# EAGLE board board (EAGLE 9.5.2)
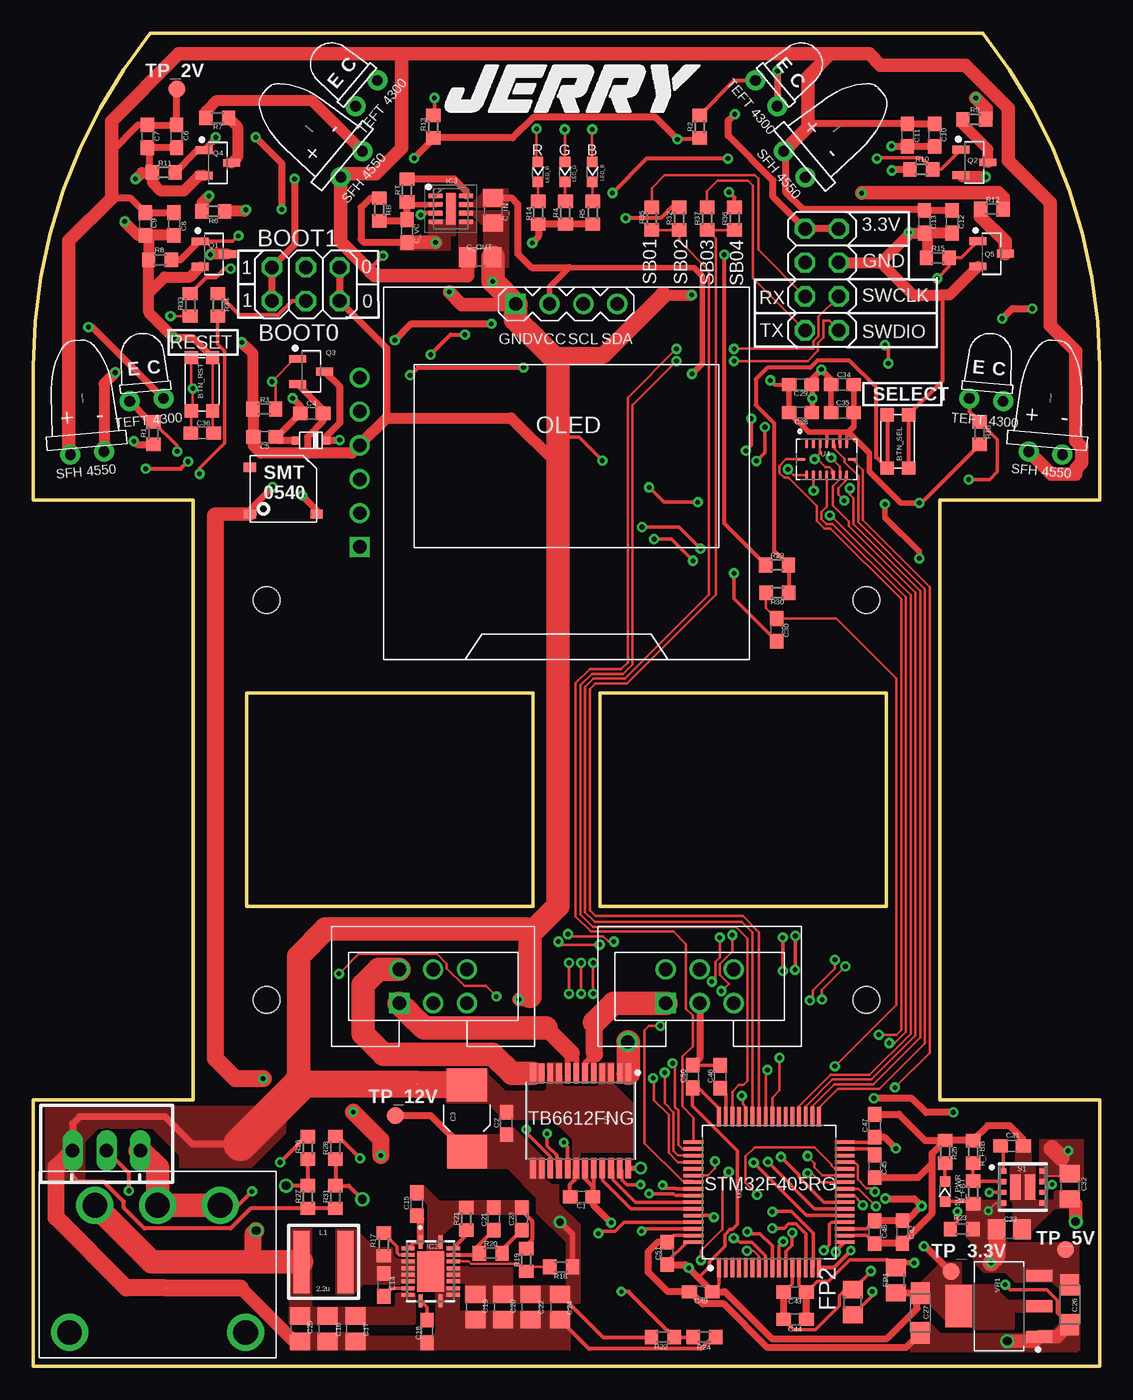
[diagram p3: board, top side]
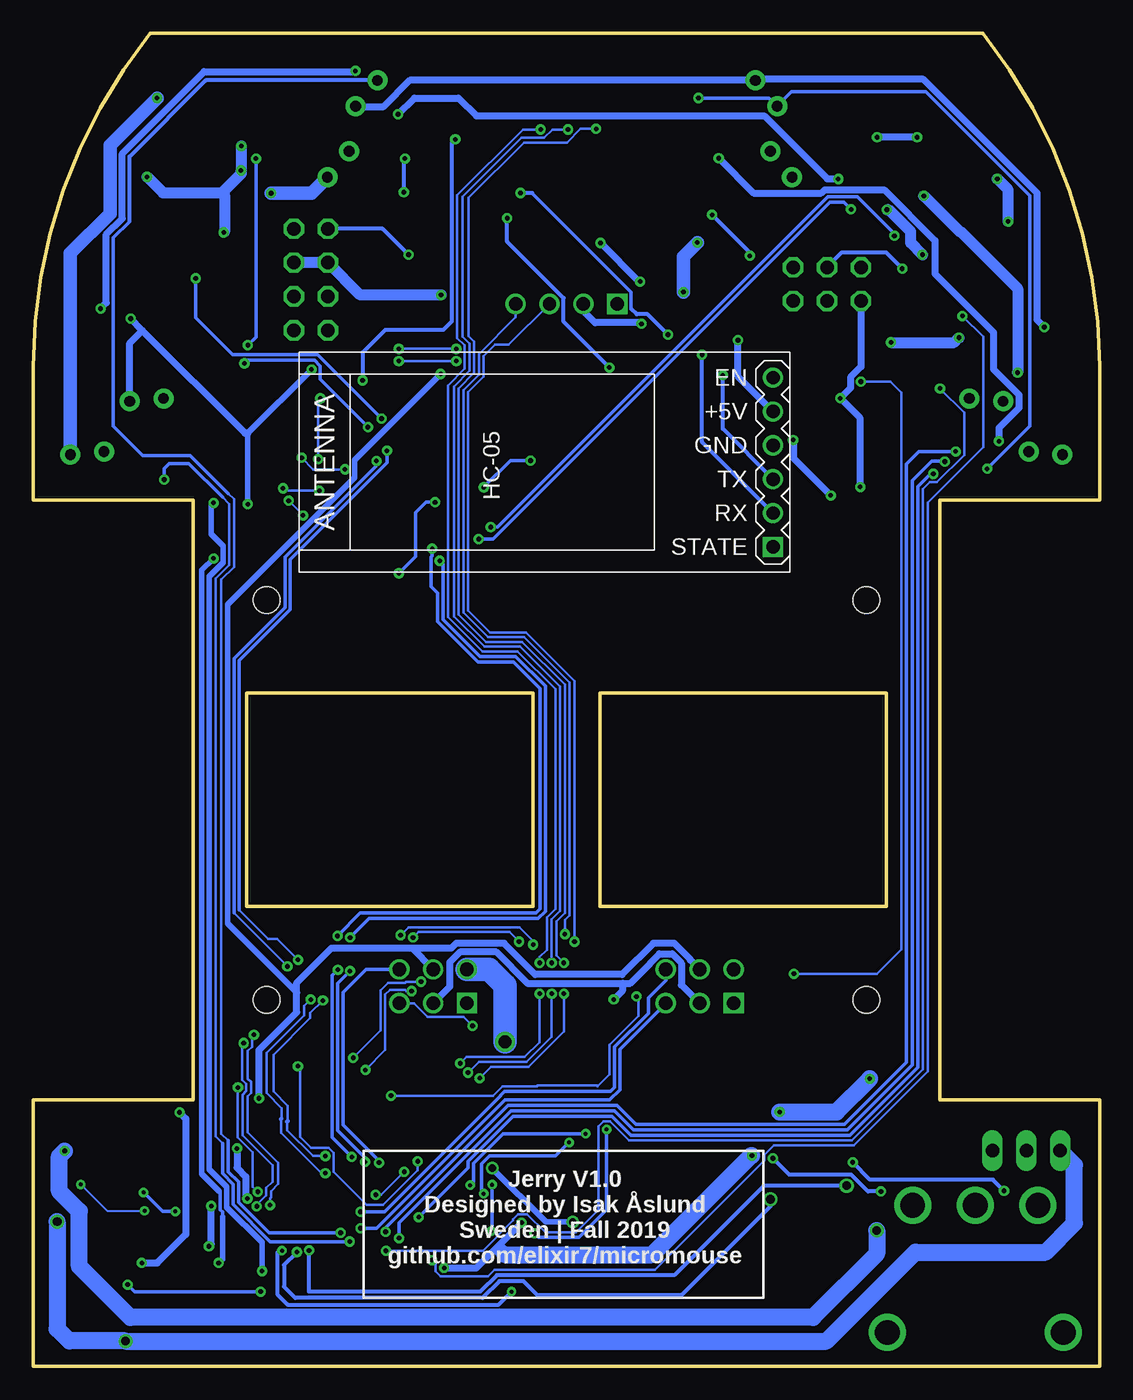
[diagram p4: board, bottom side, seen from below]

Size 80 x 100 mm. Coordinates in mm from the lower left corner, seen from the top.
Outline: 0,0 80,0 80,20 68,20 68,65 80,65 80,75 arc39 71.22,100 8.78,100 arc39 0,75 0,65 12,65 12,20 0,20 0,0
Outline: 42.5,34.5 42.5,50.5 64,50.5 64,34.5 42.5,34.5
Outline: 16,50.5 37.5,50.5 37.5,34.5 16,34.5 16,50.5
Copper layers (1*16): Top 0.035mm / dielectric 1.5mm / Bottom 0.035mm
Design rules "default *": minimum track width 6mil, minimum drill 0.3mm, track to track 6mil, track to pad 6mil, pad to pad 6mil, via to via 6mil, smd to smd 6mil, copper to edge 10mil, drill to drill 6mil, minimum pad ring 10mil, minimum via ring 8mil, stop-mask expansion 0mil, vias tented up to drill 12mil, thermal gap 10mil
Holes 2 mm at 17.5,57.5 17.5,27.5 62.5,57.5 62.5,27.5

## Footprints (pad centres in the part's own frame; a part is rotated, then mirrored left to right if it is on the bottom)
CHIP-LED0603 = smd 0.8 x 0.8: A 0,-0.75; C 0,0.75
2X03 = drill 1.016 octagon: 1 -2.54,-1.27; 2 -2.54,1.27; 3 0,-1.27; 4 0,1.27; 5 2.54,-1.27; 6 2.54,1.27
KMR621NGLFS = smd 1 x 1: 1 -2,-0.8; 2 2,-0.8; 3 -2,0.8; 4 2,0.8
C0603 = smd 1.1 x 1: 1 -0.85,0; 2 0.85,0
EIA_6032-28 = smd 2.5 x 3: 1 -2.5,0; 2 2.5,0
C0805 = smd 1.3 x 1.5: 1 -0.95,0; 2 0.95,0
SMC_A = smd 1.6 x 1.4: + -1.5,0; - 1.5,0
3MM_PHOTOTRANSISTOR = drill 0.8 pad 1.5: C 1.27,0; E -1.27,0
2X04 = drill 1.016 octagon: 1 -3.81,-1.27; 2 -3.81,1.27; 3 -1.27,-1.27; 4 -1.27,1.27; 5 1.27,-1.27; 6 1.27,1.27; 7 3.81,-1.27; 8 3.81,1.27
SFH_4545 = drill 0.8 pad 1.5: + -1.27,-0.5; - 1.27,-0.5
R0805 = smd 1.3 x 1.5: 1 -0.95,0; 2 0.95,0
WIRELESS-BLUETOOTH-HC-05 = drill 1 square: 1 -6.35,-17.145 | drill 1: 2 -3.81,-17.145; 3 -1.27,-17.145; 4 1.27,-17.145; 5 3.81,-17.145; 6 6.35,-17.145
RHL(R-PVQFN-N20)_1 = smd 0.99 x 0.3: 1 -2.2,-0.75; 10 2.2,-0.75; 11 2.2,0.75; 20 -2.2,0.75 | smd 0.3 x 0.99: 2 -1.75,-1.7; 3 -1.25,-1.7; 4 -0.75,-1.7; 5 -0.25,-1.7; 6 0.25,-1.7; 7 0.75,-1.7; 8 1.25,-1.7; 9 1.75,-1.7; 12 1.75,1.7; 13 1.25,1.7; 14 0.75,1.7; 15 0.25,1.7; 16 -0.25,1.7; 17 -0.75,1.7; 18 -1.25,1.7; 19 -1.75,1.7 | smd 3.05 x 2.05: 21 0,0
SON65P260X300X150-9N = smd 1.05 x 0.35: 1 -1.15,0.975; 2 -1.15,0.325; 3 -1.15,-0.325; 4 -1.15,-0.975; 5 1.15,-0.975; 6 1.15,-0.325; 7 1.15,0.325; 8 1.15,0.975 | smd 0.7 x 2.35: 9 0,0
XAL5030 = smd 1.18 x 4.7: 1 -1.655,0; 2 1.655,0
IE2-1024-ENCODER = drill 1.016 square: 1 -2.54,-1.27 | drill 1.016: 2 -2.54,1.27; 3 0,-1.27; 4 0,1.27; 5 2.54,-1.27; 6 2.54,1.27
DISPLAY-OLED-128X64-I2C = drill 1 square: 1 -3.81,12.7 | drill 1: 2 -1.27,12.7; 3 1.27,12.7; 4 3.81,12.7
SOT95P235X110-3 = smd 1.28 x 0.589: 1 -1.016,0.95; 2 -1.016,-0.95; 3 1.016,0
R0603 = smd 1 x 1.1: 1 -0.85,0; 2 0.85,0
LMZ21701 = smd 0.45 x 0.4: 1 -1.475,1.2; 2 -1.475,0.4; 3 -1.475,-0.4; 4 -1.475,-1.2; 5 1.475,-1.2; 6 1.475,-0.4; 7 1.475,0.4; 8 1.475,1.2 | smd 0.8 x 1.9: 9 -0.55,0; 10 0.55,0
500SSP1S1M6QEA = drill 1.85: 1 -4.7,0; 2_COM 0,0; 3 4.7,0; MOUNT@1 -6.605,9.53; MOUNT@2 6.605,9.53
PAD.03X.05 = smd 1.27 x 1.27: P$1 0,0
SOP65P760X160-24 = smd 1.515 x 0.417: 1 -3.548,3.575; 2 -3.548,2.925; 3 -3.548,2.275; 4 -3.548,1.625; 5 -3.548,0.975; 6 -3.548,0.325; 7 -3.548,-0.325; 8 -3.548,-0.975; 9 -3.548,-1.625; 10 -3.548,-2.275; 11 -3.548,-2.925; 12 -3.548,-3.575; 13 3.548,-3.575; 14 3.548,-2.925; 15 3.548,-2.275; 16 3.548,-1.625; 17 3.548,-0.975; 18 3.548,-0.325; 19 3.548,0.325; 20 3.548,0.975; 21 3.548,1.625; 22 3.548,2.275; 23 3.548,2.925; 24 3.548,3.575
LQFP-64 = smd 1.469 x 0.28: 1 -5.671,3.75; 2 -5.671,3.25; 3 -5.671,2.75; 4 -5.671,2.25; 5 -5.671,1.75; 6 -5.671,1.25; 7 -5.671,0.75; 8 -5.671,0.25; 9 -5.671,-0.25; 10 -5.671,-0.75; 11 -5.671,-1.25; 12 -5.671,-1.75; 13 -5.671,-2.25; 14 -5.671,-2.75; 15 -5.671,-3.25; 16 -5.671,-3.75; 33 5.671,-3.75; 34 5.671,-3.25; 35 5.671,-2.75; 36 5.671,-2.25; 37 5.671,-1.75; 38 5.671,-1.25; 39 5.671,-0.75; 40 5.671,-0.25; 41 5.671,0.25; 42 5.671,0.75; 43 5.671,1.25; 44 5.671,1.75; 45 5.671,2.25; 46 5.671,2.75; 47 5.671,3.25; 48 5.671,3.75 | smd 0.28 x 1.469: 17 -3.75,-5.671; 18 -3.25,-5.671; 19 -2.75,-5.671; 20 -2.25,-5.671; 21 -1.75,-5.671; 22 -1.25,-5.671; 23 -0.75,-5.671; 24 -0.25,-5.671; 25 0.25,-5.671; 26 0.75,-5.671; 27 1.25,-5.671; 28 1.75,-5.671; 29 2.25,-5.671; 30 2.75,-5.671; 31 3.25,-5.671; 32 3.75,-5.671; 49 3.75,5.671; 50 3.25,5.671; 51 2.75,5.671; 52 2.25,5.671; 53 1.75,5.671; 54 1.25,5.671; 55 0.75,5.671; 56 0.25,5.671; 57 -0.25,5.671; 58 -0.75,5.671; 59 -1.25,5.671; 60 -1.75,5.671; 61 -2.25,5.671; 62 -2.75,5.671; 63 -3.25,5.671; 64 -3.75,5.671
PQFN50P450X300X100-16N = smd 0.25 x 0.675: 1 -1.5,1.165; 2 -1,1.165; 3 -0.5,1.165; 4 0,1.165; 5 0.5,1.165; 6 1,1.165; 7 1.5,1.165; 9 1.5,-1.165; 10 1,-1.165; 11 0.5,-1.165; 12 0,-1.165; 13 -0.5,-1.165; 14 -1,-1.165; 15 -1.5,-1.165 | smd 0.675 x 0.25: 8 1.915,0; 16 -1.915,0
1N4148WX_SOD-323-2 = smd 0.6 x 0.6: + -0.935,-0.035; - 1.365,-0.035
SMT-0540-S-R = smd 0.7 x 0.9: + 1.9,-2.4; - 1.9,2.6; DUMMY_LEAD -1.6,-2.4
SPLITTER = smd 0.102 x 0.102: 1 0,0; 2 0,0
JST-XH-03 = drill 1.016 long: 1 -2.54,0; 2 0,0; 3 2.54,0
SOT230P700X180-4 = smd 1.965 x 0.889: 1 -3.023,2.3; 2 -3.023,0; 3 -3.023,-2.3 | smd 1.965 x 3.189: 4 3.023,0

## Placement (x,y rotation side)
5V_PWR  CHIP-LED0603  [CHIP-LED0603]  68.41,13.1 0 top
BOOT  [2X03]  20.44,81.18 0 top
BTN_RST  KMR621NGLFS  [KMR621NGLFS]  12.66,73.67 90 top
BTN_SEL  KMR621NGLFS  [KMR621NGLFS]  64.87,69.38 270 top
C1  0.1u  [C0603]  41.13,12.71 180 top
C2  0.1u  [C0603]  35.5,18.22 90 top
C3  10u  [EIA_6032-28]  32.53,18.61 90 top
C4  0.1u  [C0603]  20.89,71.49 0 top
C5  10u  [C0603]  17.36,69.72 180 top
C6  0.1u  [C0603]  10.75,92.27 270 top
C7  10u  [C0603]  8.57,92.27 270 top
C8  0.1u  [C0603]  10.56,85.69 270 top
C9  10u  [C0603]  8.4,85.69 270 top
C10  0.1u  [C0603]  67.62,92.36 270 top
C11  10u  [C0603]  65.58,92.36 270 top
C12  0.1u  [C0603]  68.94,85.86 270 top
C13  10u  [C0603]  66.85,85.86 270 top
C14  0.1u  [C0603]  26.3,6.09 270 top
C15  2.2u  [C0603]  28.78,12.15 90 top
C16  0.1u  [C0805]  22.09,2.81 270 top
C17  22u  [C0805]  24.18,2.81 270 top
C18  0.1u  [C0603]  29.54,2.6 270 top
C19  22u  [C0805]  33.18,4.45 270 top
C20  22u  [C0805]  35.26,4.45 270 top
C21  15p  [C0603]  34.55,11.06 90 top
C22  22u  [C0805]  37.31,4.45 270 top
C23  330p  [C0603]  36.65,11.06 90 top
C24  1u  [C0805]  39.51,4.45 270 top
C25  22u  [C0805]  20.01,2.81 270 top
C26  10u  [SMC_A]  77.75,4.61 270 top
C27  10u  [SMC_A]  66.56,4 270 top
C28  0.1u  [C0603]  57.56,71.55 180 top
C29  2.2u  [C0603]  57.56,73.64 180 top
C30  0.1u  [C0603]  55.77,55.24 270 top
C31  3300p  [C0603]  73.43,16.53 0 top
C32  22u  [C0805]  77.78,13.51 270 top
C33  22u  [C0805]  73.23,10.26 0 top
C34  0.1u  [C0603]  60.71,73.64 0 top
C35  0.1u  [C0603]  60.71,71.55 0 top
C36  0.1u  [C0603]  12.68,70.01 0 top
C42  10u  [C0603]  65.2,10.07 270 top
C43  0.1u  [C0603]  57.16,5.55 180 top
C44  1u  [C0603]  57.16,3.52 180 top
C45  2.2u  [C0603]  63.12,15.01 270 top
C46  2.2u  [C0603]  51.53,21.72 90 top
C47  0.1u  [C0603]  63.13,18.05 90 top
C48  0.1u  [C0603]  63.12,10.06 270 top
C49  0.1u  [C0603]  50.08,5.58 180 top
C50  0.1u  [C0603]  49.47,21.73 90 top
C51  0.1u  [C0603]  47.57,8.47 90 top
C_IN  10u  [C0805]  34.51,86.7 270 top
C_OUT  10u  [C0805]  33.53,83.2 0 top
C_VC  470pF  [C0603]  28.04,85.17 270 top
D4  TEFT4300  [3MM_PHOTOTRANSISTOR]  25,95.5 50 top
D5  TEFT4300  [3MM_PHOTOTRANSISTOR]  8.5,72.5 5 top
D6  TEFT4300  [3MM_PHOTOTRANSISTOR]  55,95.5 310 top
D8  TEFT4300  [3MM_PHOTOTRANSISTOR]  71.5,72.5 355 top
DEBUG  [2X04]  59.17,81.53 270 top
FL_EMITTER  SFH_4545  [SFH_4545]  4,69 5 top
FP1  10u  [R0805]  64.71,6.46 90 top
FP2  10u  [R0805]  61.49,4.8 90 top
FR_EMITTER  SFH_4545  [SFH_4545]  76,69 355 top
HC-05  WIRELESS-BLUETOOTH-HC-05  [WIRELESS-BLUETOOTH-HC-05]  41.64,67.82 90 bottom
IC2  TPS61088RHLR  [RHL(R-PVQFN-N20)_1]  29.81,7.11 270 top
IC3  LMZ10501  [SON65P260X300X150-9N]  31.33,86.83 0 top
L1  2.2u  [XAL5030]  21.78,7.82 0 top
L_EMITTER  SFH_4545  [SFH_4545]  23.5,90.5 50 top
LED_B  CHIP-LED0603  [CHIP-LED0603]  41.95,89.6 180 top
LED_G  CHIP-LED0603  [CHIP-LED0603]  39.9,89.6 180 top
LED_R  CHIP-LED0603  [CHIP-LED0603]  37.86,89.6 180 top
MOTOR_LEFT  IE2-1024-ENCODER  [IE2-1024-ENCODER]  50,28.5 0 top
MOTOR_RIGHT  IE2-1024-ENCODER  [IE2-1024-ENCODER]  30,28.5 0 top
OLED  DISPLAY-OLED-128X64-I2C  [DISPLAY-OLED-128X64-I2C]  40,67 0 top
Q1  IRFML8244TRPBF  [SOT95P235X110-3]  13.55,83.44 0 top
Q2  IRFML8244TRPBF  [SOT95P235X110-3]  70.6,90.31 0 top
Q3  IRFML8244TRPBF  [SOT95P235X110-3]  20.85,74.63 0 top
Q4  IRFML8244TRPBF  [SOT95P235X110-3]  13.85,90.27 0 top
Q5  IRFML8244TRPBF  [SOT95P235X110-3]  71.9,83.46 0 top
R1  1.8k  [R0603]  9,70 90 top
R2  1.8k  [R0603]  50,93 90 top
R3  10k  [R0603]  17.34,71.81 0 top
R4  1k  [R0603]  39.93,86.53 90 top
R5  1k  [R0603]  41.98,86.53 90 top
R6  0.75  [R0603]  13.5,86.64 180 top
R7  0.75  [R0603]  13.81,93.66 180 top
R8  10k  [R0603]  9.51,83.01 0 top
R9  0.75  [R0603]  70.59,93.55 0 top
R10  10k  [R0603]  66.61,89.8 0 top
R11  10k  [R0603]  9.79,89.56 0 top
R12  0.75  [R0603]  71.92,86.81 0 top
R13  1.8k  [R0603]  30,93 90 top
R14  1k  [R0603]  37.89,86.53 90 top
R15  10k  [R0603]  67.86,83.15 0 top
R16  1.8k  [R0603]  71,70 90 top
R17  150k  [R0603]  26.29,9.13 90 top
R18  180k  [R0603]  39.61,7.45 180 top
R19  20k  [R0603]  37,7.97 90 top
R20  56k  [R0603]  34.32,8.47 0 top
R21  112k  [R0603]  32.48,11.06 90 top
R22  47k  [R0603]  47.23,2.18 180 top
R23  10k  [R0603]  69.66,10.29 0 top
R24  10k  [R0603]  50.36,2.2 180 top
R25  1k  [R0603]  68.41,16.09 270 top
R26  20k  [R0603]  20.59,16.38 90 top
R27  10k  [R0603]  20.59,12.69 90 top
R28  20k  [R0603]  22.67,16.39 90 top
R29  100k  [R0603]  55.8,60.11 0 top
R30  10k  [R0603]  55.83,58.03 180 top
R31  10k  [R0603]  22.67,12.7 90 top
R32  0  [R0603]  48.47,86.09 90 top
R33  10k  [R0603]  11.77,79.62 90 top
R34  10k  [R0603]  13.84,79.62 270 top
R35  0  [R0603]  46.4,86.09 90 top
R36  0  [R0603]  52.61,86.09 90 top
R37  0  [R0603]  50.55,86.09 90 top
R_EMITTER  SFH_4545  [SFH_4545]  57.5,90.5 310 top
R_FBB  20k  [R0603]  70.51,16.08 270 top
R_FBT  105k  [R0603]  70.51,13.03 90 top
RB  150k  [R0603]  25.97,86.78 270 top
RT  290k  [R0603]  28.04,88.21 90 top
S1  LMZ21701  [LMZ21701]  74.24,13.44 0 top
SW  SPDT-500SSP1S1M6QEA  [500SSP1S1M6QEA]  9.32,12.06 180 top
TP_2V  TEST-POINT3X5  [PAD.03X.05]  10.79,95.82 0 top
TP_3.3V  TEST-POINT3X5  [PAD.03X.05]  68.85,7.09 0 top
TP_5V  TEST-POINT3X5  [PAD.03X.05]  77.46,8.76 0 top
TP_12V  TEST-POINT3X5  [PAD.03X.05]  27.15,18.8 0 top
U1  TB6612FNG  [SOP65P760X160-24]  41.07,18.41 270 top
U3  STM32F405RG  [LQFP-64]  55.2,13.06 90 top
U4  BMI088  [PQFN50P450X300X100-16N]  59.53,68.04 0 top
U$1  1N4148WX  [1N4148WX_SOD-323-2]  20.62,69.47 0 top
U$4  SMT-0540-S-R  [SMT-0540-S-R]  18.65,65.83 270 top
U$6  SPLITTER  [SPLITTER]  28.76,21.16 90 top
U$7  SPLITTER  [SPLITTER]  9.94,5.87 90 top
U$10  JST-XH-3  [JST-XH-03]  5.49,16.17 0 top
VR1  LM1117-3.3  [SOT230P700X180-4]  72.45,4.5 180 top

## Tracks (layer width: path | path; a pad name or v marks a point on that pad's centre or on a via)
2V  (via drill 0.35)
  Top 0.305: IC3.3 30.17,86.51 29.2,86.51 v29.07,86.39 | v26.24,83.31 25.29,82.36 25.29,82.16
  Top 0.508: TP_2V.P$1 10.75,95.78 C6.1 C7.1 7.85,93.11 5.87,91.14 | C8.1 C9.1 7.31,87.63 5.87,87.63 | C10.1 C11.1 58.36,93.21 58.12,92.97 | R_EMITTER.+ 56.44,91.01 56.44,88.09 57.73,86.79 66.77,86.79 C13.1 C12.1
  Top 1.016: C_OUT.1 32.58,81.81 25.63,81.81 25.29,82.16 23.07,84.38 L_EMITTER.+ 23.32,89.46 25.73,89.46 27.64,91.36 27.64,98.27 27.46,98.45 | FL_EMITTER.+ 2.67,68.5 2.67,84.43 5.87,87.63 5.87,91.14 5.87,93.4 10.92,98.45 27.46,98.45 | 27.46,98.45 59.82,98.45 | 59.82,98.45 62.71,98.45 63.55,97.61 69.93,97.61 73.15,94.39 73.15,90.45 76.3,87.3 76.3,78.05 78.21,76.15 78.21,69.41 78.68,68.94 78.68,67.79 78.21,67.32 78.21,66.93 76.38,66.93 FR_EMITTER.+ | R_EMITTER.+ 58.12,92.97 58.12,96.75 59.82,98.45
  Bottom 0.305: v29.07,86.39 26.24,83.55 v26.24,83.31
  pour Top (no thermals): 31.95,85.98 32.97,85.98 33.25,85.7 33.25,82.42 31.95,82.42
3.3V  (via drill 0.35)
  Top 0.254: C51.1 47.57,7.85 49.02,9.31 U3.64 | C49.1 51.45,6.11 U3.1 | C47.1 62.74,16.81 U3.32 | U3.19 62.52,10.31 C48.1 | U3.48 51.45,19.33 49.9,20.88 C50.1 49.47,19.52 52.83,16.15 52.83,10.64 52.45,10.26 52.28,10.26 51.9,9.87 51.9,8.99 50.75,7.85 50.75,7.47 49.91,6.63
  Top 0.305: U1.19 41.35,14.82 41.35,14.1 41.98,13.47 C1.1 42.04,12.77 42.05,12.78 U1.20 | R29.1 51.84,63.22 v51.84,83.39
  Top 0.508: 66.31,5.5 C27.+ | C48.1 C42.1 65.56,10.92 v66.65,12.01 66.09,12.57 v63.94,12.57 | C51.1 48.92,7.62 v49.17,7.37 49.91,6.63 50.93,5.61 C49.1 51.89,5.58 55.42,2.06 64.04,2.06 66.31,4.32 66.31,5.5 | v43.36,10.77 42.04,12.09 42.04,12.77 | TP_3.3V.P$1 66.95,8.99 v66.83,8.99 | C47.1 63.85,17.2 v64.72,16.33 | FP1.1 66.3,5.51 66.31,5.5 | U$1.+ 18.49,69.44 C5.1 18.27,69.72 C4.1 20.04,72.03 v19.46,72.62 | U$4.+ 16.25,64.26 v17.96,65.96 | DEBUG.2 DEBUG.1 55.5,87.74 55.5,88.95 52.15,92.3 52.15,93.45 v52.63,93.93 | v19.61,89.08 19.61,84.16 BOOT.2 BOOT.1
  Top 1.016: 13.68,63.8 13.8,63.93 U$4.+
  Top 1.27: v26.09,15.8 26.09,16.99 v24,19.07 | v17.25,21.57 15.18,21.57 13.68,23.06 13.68,63.8
  Bottom 0.305: v51.84,83.39 53.79,85.34 DEBUG.1
  Bottom 0.508: v49.17,7.37 46.76,7.37 45.36,8.76 | 45.36,8.76 v43.36,10.77 | v66.83,8.99 66.65,9.17 v66.65,12.01 | v64.72,16.33 64.72,14.88 64.06,14.22 64.06,12.7 v63.94,12.57 | v17.96,65.96 17.96,71.12 v19.46,72.62 18.69,73.38 18.69,74.19 17.9,74.98 BOOT.1 | 45.36,8.76 45.03,8.76 | v52.63,93.93 51.41,95.15 48.11,95.15 46.76,93.8 25.15,93.8 20.42,89.08 v19.61,89.08
  Bottom 1.016: 45.03,8.76 44.63,8.36
  Bottom 1.27: 44.63,8.36 33.59,8.36 26.14,15.8 v26.09,15.8 | v24,19.07 19.74,19.07 v17.25,21.57
  pour Top (no thermals): 65.89,6.27 65.89,4.67 67.16,4.67 67.21,4.72 68.48,3.45 68.48,2.95 70.41,2.95 70.59,2.77 73.56,2.77 73.56,4.06 76.4,4.06 76.45,4.11 76.45,4.9 76.43,4.93 73.08,4.93 71.91,6.1 69.62,6.1 69.62,7.8 68.12,7.8 66.6,6.27
3.3VA  (via drill 0.35)
  Top 0.203: U4.3 59.03,68.45 v58.62,68.05 58.86,68.05 59.44,67.47 59.72,67.47 59.91,67.28 59.91,67 U4.11
  Top 0.254: U3.13 57.45,6.11 C43.1 58.83,6.38 59.66,6.38 61.28,7.99 64.13,7.99 FP1.2
  Top 0.406: FP1.2 65.05,7.75 v66.09,7.75 | C35.1 C34.1 59.86,74.05 v59.13,74.78 58.41,74.06 C29.1 58.46,73.59 v58.46,72.61 58.46,71.6 C28.1 | v63.91,64.67 63.91,63.68 66.48,61.1 v66.48,60.6
  Top 0.508: C44.1 C43.1 | v72.69,78.59 73.46,79.35 v74.95,79.35 | v55.83,97.18 55.82,97.17 D6.C | v4.14,77.95 4.42,77.95 D5.C
  Bottom 0.203: v58.46,72.61 58.62,72.45 v58.62,68.05
  Bottom 0.254: 65.81,11.2 65.81,11.58 65.96,11.73 65.96,13.03 66.06,13.13
  Bottom 0.406: v66.09,7.75 65.81,8.03 65.81,11.2 | 66.06,13.13 67.36,14.43 67.36,59.72 v66.48,60.6 | v63.91,64.67 63.91,70 v59.13,74.78
  Bottom 0.508: 63.91,70 64.11,70 71.82,77.71 | 71.82,77.71 v72.69,78.59 | v74.95,79.35 74.52,79.78 74.52,84.91 73.33,86.11 73.33,90.98 67.18,97.13 55.88,97.13 v55.83,97.18 | D8.C 72.77,76.77 71.82,77.71 | D6.C 55.75,94.46 53.77,94.46 51.76,96.47 D4.C 25.74,96.55 13.22,96.55 4.7,88.03 4.7,78.51 v4.14,77.95
5V  (via drill 0.3, 0.35)
  Top 0.152: S1.6 75.85,13.04 v76.45,13.64 | v71.65,11.66 72.23,12.24 S1.4
  Top 0.254: 5V_PWR.A 70.34,12.35 R_FBT.1
  Top 0.406: v49.43,74.45 50.22,75.23 50.22,81.76 49.55,82.42 40.21,82.42 38.73,80.94 OLED.2
  Top 0.508: v69.03,19.04 v69.02,19.04 66.99,19.04 65.93,20.09 v63.07,20.09 | C_IN.1 35.9,87.65 36.35,87.2 36.35,83.46 37.39,82.42 40.21,82.42 | v27.13,76.99 28.35,78.21 v34.37,78.21
  Top 1.27: C33.1 72.28,8.17 v71.86,7.75
  Bottom 0.152: v76.45,13.64 74.46,11.66 v71.65,11.66
  Bottom 0.406: 60.23,28.04 65.43,33.23 65.43,57.13 55.88,66.68 55.88,67.99 v49.43,74.45
  Bottom 0.508: v71.86,7.75 70.69,7.75 68.55,9.88 68.55,18.56 v69.03,19.04 | v63.07,20.09 63.07,23.72 60.23,26.56 60.23,28.04 60.23,28.77 57.63,31.37 51.6,31.37 | MOTOR_LEFT.4 51.6,31.37 | 51.6,31.37 48.63,31.37 48.27,31.73 44.68,31.73 42.34,29.39 35.81,29.39 33.48,31.73 31.91,31.73 30.71,30.53 30.71,30.48 MOTOR_RIGHT.4 | HC-05.5 27.13,74.26 v27.13,76.99 | v34.37,78.21 34.44,78.28 37.85,78.28 38.38,78.82 38.73,79.17 OLED.2
  pour Top (no thermals): 69.98,12.67 71.07,12.67 71.09,12.65 71.09,12.45 72.85,12.45 72.85,9.55 73.13,9.27 78.46,9.27 78.46,5.36 78.49,5.33 77.11,5.33 77.09,5.31 77.09,5.71 76.45,6.35 73.69,6.35 72.97,7.06 71.35,7.06 70.59,7.82 70.59,9.14 70,9.73 70,12.65
  pour Top (no thermals): 31.98,87.3 31.98,86.94 35.61,86.94 35.61,88.29 33.73,88.29 33.73,88.04 32.99,87.3
12V  (via drill 0.55)
  Top 0.305: C24.1 42.73,2.18 R22.2
  Top 0.406: U1.24 v45.57,14.86 | v39.52,10.82 40.46,9.89 R18.1
  Top 0.508: C3.1 29.84,18.8 TP_12V.P$1
  Bottom 0.406: v45.57,14.86 41.53,10.82 v39.52,10.82
  pour Top (no thermals): 35.94,7.47 35.94,6.02 40.01,6.02 40.01,9.32 37.77,11.56 37.77,12.67 35.61,14.83 31.06,14.83 31.06,17.32 31.09,17.35 35,17.35 35,17.86 35.03,17.88 35.99,17.88 38.28,15.6 38.35,15.6 38.35,14.12 38.89,13.59 39.42,13.59 39.42,12.19 41.02,10.59 41.02,4.75 32.44,4.75 32.44,6.27 31.09,6.27 31.09,7.47
BOOT0  (via drill 0.35)
  Top 0.254: U3.60 50.95,11.31 v51.08,11.18 | v12.47,66.95 12.47,67.37 14.36,69.26 14.36,76.17 13.84,76.69 R34.2
  Bottom 0.254: v51.08,11.18 47.37,14.88 47.37,15.37 44,18.74 36.57,18.74 35.15,17.32 18.74,17.32 13.63,22.44 13.63,65.98 12.65,66.95 v12.47,66.95
BOOT1  (via drill 0.35)
  Top 0.203: U3.28 60.14,14.81 59.88,15.06 59.88,15.15 58.6,16.43 54.13,16.43 53.42,15.72 53.42,13.74 v54.3,12.85 | v50.09,7.95 50.09,8.64 51.71,10.26 51.71,14.12 v52.17,14.58 | v10.29,78.79 11.75,78.79 R33.1
  Bottom 0.203: v54.3,12.85 53.9,12.85 v52.17,14.58 | v50.09,7.95 49.81,7.67 49.81,7.1 49.44,6.73 45.9,6.73 45.39,7.24 33.35,7.24 25.14,15.44 25.14,15.86 24.41,16.59 18.42,16.59 12.89,22.12 12.89,64.79 8.73,68.95 8.73,77.23 v10.29,78.79
BT_RX  (via drill 0.35)
  Top 0.305: R32.2 47.88,86.94 47.08,86.14 v44.45,86.14 v44.45,86.13 | v28.27,74.35 28.85,74.93 v36.78,74.93
  Bottom 0.305: HC-05.3 28.27,70.33 v28.27,74.35 | v36.78,74.93 40.21,78.36 40.21,80.14 44.45,84.38 v44.45,86.13
BT_TX  (via drill 0.35)
  Top 0.305: R36.2 52.61,87.67 v52.2,88.09 | v52.12,90.6 46.02,90.6 v43.45,88.02 | v29.82,75.89 31.32,77.39 v32.38,77.39
  Bottom 0.254: 35.13,79.32 35.16,79.35 35.16,80.57 42.58,87.99 42.58,88.02
  Bottom 0.305: v52.2,88.09 52.2,90.53 v52.12,90.6 | HC-05.2 29.82,69.33 v29.82,75.89 | 42.58,88.02 v43.45,88.02 | v32.38,77.39 33.91,78.92 34.73,78.92 35.13,79.32
BTN_SEL  (via drill 0.35)
  Top 0.203: U3.54 50.63,14.31 51.16,14.83 v51.16,15.37 | v60.15,22.5 64.76,27.12 64.76,51.59 60.26,56.09 C30.1 54.98,56.88 R30.2
  Bottom 0.203: v60.15,22.5 59.97,22.33 59.97,17.63 59.97,17.45 59.97,17.22 59.15,16.39 57.83,16.39 57.46,16.02 57.46,14.58 54.99,12.12 53.75,12.12 51.16,14.71 v51.16,15.37
BUZZER  (via drill 0.35)
  Top 0.203: U3.44 53.45,19.47 53.24,19.68 53.24,20.22 v53.16,20.3 | v34.75,27.74 33.96,28.52 32.35,28.52 31.02,29.86 31.02,30.19 30.29,30.91 24.41,30.91 v22.94,29.44 | R3.2 18.18,73.58 v17.91,73.86 19.62,75.58 Q3.1
  Bottom 0.203: v53.16,20.3 45.52,20.3 44.81,21.01 42.22,21.01 42.16,21.06 37.72,21.06 37.67,21.01 36.78,21.89 36.78,24.1 34.59,26.29 34.59,27.58 v34.75,27.74 | v22.94,29.44 16.71,29.44 14.88,31.27 14.88,73.05 15.7,73.86 v17.91,73.86
CS_ACCEL  (via drill 0.35)
  Top 0.203: U4.14 58.53,65.7 v58.55,65.68 | v61.27,65.86 61.27,65.4 61.54,65.13 61.54,63.18 66.55,58.17 66.55,24.66 63.04,21.16 60.12,21.16 58.45,19.49 U3.34
  Bottom 0.203: v58.55,65.68 61.09,65.68 v61.27,65.86
CS_GYRO
  Top 0.203: U4.5 60.15,69.09 60.15,68.8 60.85,68.1 60.85,67.85 61.9,66.8 61.9,63.33 66.91,58.32 66.91,24.23 63.47,20.8 60.37,20.8 58.95,19.38 U3.33
ENC_L_A  (via drill 0.35)
  Top 0.254: U3.15 58.52,7.46 58.52,9.96 56.87,11.61 55.47,11.61 v55.45,11.58
  Bottom 0.254: v55.45,11.58 53.65,11.58 44.96,20.27 44.96,20.32 44.65,20.62 36.68,20.62 36.4,20.9 36.4,23.95 33.86,26.49 33.86,27.64 32.54,28.96 MOTOR_RIGHT.6
ENC_L_B  (via drill 0.35)
  Top 0.254: v55.45,10.34 56.35,10.34 56.67,10.66 57.22,10.66 57.95,9.93 U3.14
  Bottom 0.254: MOTOR_RIGHT.5 35.99,23.78 35.99,20.74 36.76,19.96 44.62,19.96 54.24,10.34 v55.45,10.34
ENC_R_A  (via drill 0.35)
  Top 0.254: U3.21 58.01,11.31 v54.05,15.27
  Bottom 0.254: v54.05,15.27 54.05,15.4 56.77,18.12 56.77,28.04 55.04,29.77 MOTOR_LEFT.6
ENC_R_B  (via drill 0.35)
  Top 0.203: U3.55 49.42,13.92 48.69,13.92 45.87,16.73 45.87,25.2 46.2,25.53 v47.04,25.53
  Bottom 0.203: v47.04,25.53 47.73,26.21 50.42,26.21 51.44,27.23 MOTOR_LEFT.5
FL_EMITTER  (via drill 0.35)
  Top 0.254: v56.11,15.7 57.43,14.37 57.43,14.21 59.33,12.31 U3.23 | v57.15,29.74 57.17,29.77 v57.17,32.28 | v50.07,61.34 48.45,62.96 v45.67,62.96 | v15.39,84.81 14.97,84.39 Q1.1
  Top 0.508: R8.2 11.05,83.01 12.43,84.39 Q1.1
  Bottom 0.254: v56.11,15.7 57.58,17.17 57.58,29.31 v57.15,29.74 | v57.17,32.28 55.47,33.99 42.29,33.99 41.99,34.29 41.99,50.85 43.98,52.84 46.63,52.84 49.66,55.86 49.66,57.99 50.16,58.49 50.16,60.7 50.07,60.79 v50.07,61.34 | v45.67,62.96 45.17,62.96 20.4,87.73 18.16,87.73 15.39,84.96 v15.39,84.81
FL_RECEIVER  (via drill 0.35)
  Top 0.254: U3.9 55.45,9.02 54.53,9.93 53.72,9.93 v53.57,10.08 | v10.79,68.63 10.79,69.06 R1.2
  Top 0.508: D5.E 8.77,70.85 R1.2
  Bottom 0.254: v53.57,10.08 53.57,10.36 44.37,19.56 36.22,19.56 34.8,18.14 19.15,18.14 14.5,22.78 14.5,67.69 13.56,68.63 v10.79,68.63
FR_EMITTER  (via drill 0.35)
  Top 0.203: U3.26 59.08,13.81 58.43,14.46 58.11,14.46 | v59.18,27.51 59.18,28.25 v60.94,30
  Top 0.254: v54.25,67.92 54.89,68.56 v54.89,70.46 | v63.3,90.6 63.35,90.65 66.61,90.65 R10.2 68.13,89.8 Q2.1 | v64.16,75.24 64.16,76.35 v63.91,76.61
  Top 0.305: 58.11,14.46 v58.09,14.48
  Bottom 0.203: v58.09,14.48 58.38,14.48 61.42,17.51 61.42,18.54 | 61.37,18.59 61.37,19.36 62.51,20.5 62.51,23.49 59.67,26.33 59.67,27.02 v59.18,27.51 | v60.94,30 64.95,34.01
  Bottom 0.254: v54.25,67.92 54.25,67.56 61.12,60.7 61.12,56.93 64.95,53.1 64.95,34.01 | v54.89,70.46 58.47,74.04 58.47,75.05 58.91,75.49 63.91,75.49 v64.16,75.24 | v63.91,76.61 63.3,77.22 v63.3,90.6
  Bottom 0.305: 61.42,18.54 61.37,18.59
FR_RECEIVER  (via drill 0.35)
  Top 0.254: U3.10 55.95,9.04 v56.26,9.35 | R16.2 72.34,69.51 72.34,67.11 71.75,66.52 v70.18,66.52
  Top 0.305: D8.E 70.23,71.61 R16.2
  Bottom 0.203: 65.81,65.19 65.29,64.67 65.29,60.11 66.32,59.08 66.32,17.24 65.81,16.73
  Bottom 0.254: 65.81,65.19 68.34,67.72 69.8,67.72 70.18,67.33 v70.18,66.52 | v56.26,9.35 62.21,9.35 65,12.13 65,13.64 65.81,14.45 65.81,16.73
GND  (via drill 0.35, 0.65)
  Top 0.203: C36.2 13.46,70.08 BTN_RST.1 BTN_RST.2
  Top 0.254: C51.2 48.05,9.81 U3.63 | U3.18 62.52,9.81 C48.2 | 74.28,17.01 C31.2 | C50.2 C46.2 | C26.- 76.84,4.02 76.84,4.96 76.05,5.74 73.3,5.74 v72.92,6.12 | FP2.1 62.94,5.3 v62.94,5.59 | C30.2 52.58,57.58 v52.58,59.49 | v49.86,64.82 47.32,64.82 v46.2,65.94 | v42.7,67.94 40.95,69.7 39.37,69.7
  Top 0.305: R31.1 R27.1 16.3,11.84 14.79,10.34 8.33,10.34 6.78,11.89 6.78,12.34 5.28,13.84 3.38,13.84 2.95,14.27 U$10.1 | BTN_SEL.4 BTN_SEL.3 68.2,73.91 68.2,80.37
  Top 0.508: C27.- 65.46,1.4 55.09,1.4 51.81,4.67 50.21,4.67 49.3,5.58 C49.2 47.61,5.58 46.15,7.04 46.15,8.61 46.87,9.32 C51.2 | C48.2 C42.2 67.45,11.47 67.45,15.21 | 74.28,17.01 73.25,18.03 71.61,18.03 R_FBB.1 R25.1 | MOTOR_LEFT.3 50,23.1 C50.2 | 36.23,79.66 OLED.1 | Q3.2 21.74,71.77 C4.2 21.74,70.89 20.57,69.72 20.57,68.5 | 16.48,69.74 C5.2 | 26.52,71.15 26.52,76.37 BOOT.5 BOOT.6 | R11.1 8.69,89.81 8.69,91.3 C7.2 C6.2 | R5.1 R4.1 R14.1 37.89,84.73 v37.44,84.28 | 67.08,83.15 R15.1 | v64.39,91.54 64.42,91.51 C11.2 C10.2 | v64.41,89.71 64.5,89.8 R10.1 | Q2.2 69.72,89.23 | v65.71,85.06 66.8,85.06 C13.2 | BTN_RST.2 11.96,77.17 v10.54,77.17 | RB.1 25.3,87.63 24.59,86.92 24.59,84.53 24.8,84.32 C_VC.2 | R25.1 67.45,15.98 67.45,15.21 | C47.2 64.94,18.9 66.91,16.94 R25.1 | 67.45,15.21 66.4,14.16 C45.2 | 15.52,16.66 11.94,16.66 9.88,18.72 3.48,18.72 2.95,18.19 U$10.1
  Top 0.813: C5.2 16.51,69.06 17.06,68.5 20.57,68.5 23.91,68.5 HC-05.4 24.5,69.12 26.52,71.15 35.86,71.15 39.37,67.64 | 16.48,69.74 R3.1 16.48,75.97 v15.65,76.81 | Q4.2 12.43,89.32 11.28,88.17 9.57,88.17 8.94,88.8 R11.1 8.15,89.56 v7.67,89.08 | v71.47,89.23 69.72,89.23 | 8.66,80.52 R8.1 8.66,84.58 C9.2 | C9.2 7.84,84.84 6.86,85.82 v6.86,85.88 | 47.27,80.37 v49.4,80.37 | C13.2 67.08,84.78 67.08,83.15 | C12.2 C13.2 | DEBUG.4 63.58,82.8 | 63.58,82.8 66.02,80.37 68.2,80.37 68.74,80.37 Q5.2 | 63.58,82.8 65.79,85.01 C13.2 | v34.47,81.38 34.51,81.38 36.23,79.66 | v10.54,77.17 8.66,79.05 8.66,80.52 | C8.2 C9.2 | 38.89,75.83 37.64,77.08 | 8.66,80.52 9.85,81.71 11.76,81.71 Q1.2
  Top 1.016: C32.2 78.21,12.13 v78.21,10.85 | C26.- 76.84,2.2 VR1.1 75.15,1.88 v73.08,1.88 | C_VC.2 30.16,84.32 v30.18,84.3 | v31.22,80.59 32.15,79.66 36.23,79.66 | 37.29,27.74 37.06,27.51 v36.45,27.51
  Top 1.27: U$7.2 6.99,5.87 1.7,11.15 1.7,14.92 U$10.1 | 47.27,80.37 42.73,75.83 38.89,75.83
  Top 1.778: C_OUT.2 34.48,81.41 36.23,79.66 | OLED.1 36.19,78.53 37.64,77.08 39.37,75.35 39.37,69.7 39.37,67.64 39.37,34.52 37.29,32.43 | 37.29,27.74 37.29,32.43 | 37.29,32.43 36.93,32.79 21.95,32.79 19.91,30.76 19.91,21.16
  Top 2.032: U$6.2 20.02,21.16 19.91,21.16
  Top 2.54: 20.02,21.16 15.52,16.66
  Bottom 0.254: v72.92,6.12 72.39,5.59 v62.94,5.59 | v52.58,59.49 51.31,60.76 51.31,64.03 50.52,64.82 v49.86,64.82 | v46.2,65.94 44.2,67.94 v42.7,67.94
  Bottom 0.508: MOTOR_LEFT.3 48.76,28.48 48.76,30.31 48,31.07 45.26,31.07 42.92,28.73 35.76,28.73 | 35.76,28.73 35.2,28.73 33.71,30.22 33.71,30.25 33.02,30.94 32.06,30.94 31.37,30.25 31.37,28.6 MOTOR_RIGHT.3 | 64.39,89.74 v64.41,89.71 | 65.66,87.86 65.66,88.03 65.66,88.04 | 65.66,85.11 v65.71,85.06 | v37.44,84.28 34.54,81.38 v34.47,81.38 | 66.6,88.03 66.6,88.04 | v36.45,27.51 35.76,28.19 35.76,28.73
  Bottom 0.813: v64.39,91.54 64.39,89.74 64.39,89.48 65.66,88.21 65.66,87.86 65.66,85.11 | v71.47,89.23 70.27,88.03 66.6,88.03 | v6.86,85.88 6.86,88.27 v7.67,89.08 | v49.4,80.37 55.47,80.37 DEBUG.3 DEBUG.4 | 66.6,88.04 65.66,88.04 | v15.65,76.81 10.9,76.81 v10.54,77.17
  Bottom 1.016: v30.18,84.3 31.22,83.26 v31.22,80.59
  Bottom 1.27: v78.21,10.85 78.21,2.79 77.31,1.89 73.09,1.89 v73.08,1.88 20.5,1.88 13.82,8.56 4.04,8.56 1.88,10.72 1.88,15.1 U$10.1
  pour Top (no thermals): 65.84,3.3 65.86,3.28 67.21,3.28 68.05,2.44 70.74,2.44 74.4,2.44 74.57,2.62 76.48,2.62 77.06,3.2 77.06,3.89 77.09,3.91 78.51,3.91 78.51,1.27 78.31,1.07 65.89,1.07 65.84,1.12
  pour Top (no thermals): 73.74,16.99 73.74,15.32 73.3,14.88 73.3,12.5 73.53,12.27 73.53,9.6 73.56,9.58 74.8,9.58 74.85,9.53 74.85,10.11 76.61,11.86 78.05,11.86 78.08,11.84 78.08,13.13 78.11,13.16 76.63,13.16 76.61,13.18 76.61,12.45 75.23,12.45 75.16,12.52 75.16,14.4 75.13,14.43 75.13,14.91 74.83,15.21 74.83,16.99
  pour Top (no thermals): 0.94,14.07 0.94,19.48 18.92,19.48 18.92,17.5 16.33,14.91 11.02,14.91 11,14.94 11,15.85 8.97,17.88 4.88,17.88 3.86,16.87 3.86,14.07
  pour Top (no thermals): 30.99,88.01 31.67,88.01 31.67,84.81 31.27,84.81 31.27,83.72 27.56,83.72 27.56,84.76 27.53,84.79 29.62,84.79 29.69,84.86 29.69,85.98 30.99,85.98
  pour Top (no thermals): 31.95,86.66 31.95,86.33 31.98,86.36 32.99,86.36 33.81,85.55 33.81,82.47 35.64,82.47 35.66,82.45 35.66,86.64 31.98,86.64
GND_A  (via drill 0.35)
  Top 0.254: C43.2 56.95,6.2 U3.12 | C44.2 57.09,2.74 58.67,2.74 60.46,4.53 60.46,5.28 60.94,5.75 FP2.2 62.84,7.1 v62.84,7.14 | U4.7 61.03,69.94 61.16,70.08 | U4.6 60.53,70.08 | U4.4 59.53,70.07 59.54,70.08
  Top 0.305: R16.1 66.62,64.77 v66.48,64.77 | R2.1 49.9,92.05 v48.34,92.05 | v55.3,73.97 55.62,73.64 C29.2
  Top 0.406: v66.48,64.77 65.1,64.77 62.74,67.13 62.74,68.5 61.16,70.08 | 61.16,70.08 60.53,70.08 59.54,70.08 58.18,70.08 C28.2 C29.2 | 61.16,70.08 61.56,70.47 C35.2 C34.2
  Top 0.508: C44.2 C43.2 | v48.34,92.05 46.69,93.7 37.52,93.7 35.97,92.15 R13.1 30,92.05 v28.57,90.63 | v7.54,69.39 7.79,69.15 R1.1
  Bottom 0.305: v48.34,92.05 48.62,91.77 48.62,78.38 49.25,77.75 53.59,77.75 55.3,76.05 v55.3,73.97
  Bottom 0.406: v62.84,7.14 62.84,9.29 65.48,11.93 65.48,13.44 66.8,14.76 66.8,59.24 65.75,60.3 65.75,61.53 66.65,62.44 66.65,64.59 v66.48,64.77
  Bottom 0.508: v28.57,90.63 25.96,88.01 20.87,88.01 20.62,88.27 16.16,88.27 12.35,84.45 12.35,81.96 7.95,77.56 7.95,74.79 6.04,72.88 6.04,71.89 7.54,70.39 v7.54,69.39
GND_M
  Top 0.305: U1.18 40.61,14.73 40.61,13.98 40.28,13.65 C1.2
  Top 0.406: U1.18 40.72,14.89
  Top 2.032: C3.2 28.81,21.11 U$6.1
  pour Top (no thermals): 39.7,20.88 39.6,22.71 38.58,22.71 38.58,20.83 38.33,20.57 35.43,20.57 34.06,21.95 34.06,22.3 34.01,22.35 30.99,22.35 30.99,19.86 31.04,19.81 34.09,19.81 35.03,18.87 35.03,18.54 38.94,18.54 40.51,16.97 40.51,14.07 40.97,14.07 40.97,16.1 45.11,16.1 45.11,19.56 43.54,21.13 43.54,22.71 42.52,22.71 42.49,22.68 42.49,20.9 39.7,20.9
GND_SW
  Top 0.305: C23.2 36.65,11.69 37.45,10.88 37.45,9.53 37,9.08 R19.2 | R24.1 50.99,2.2 50.09,1.29 41.71,1.29 C24.2
  Top 1.016: 15.54,5.87 19.55,1.85 C25.2
  Top 1.27: U$7.1 15.54,5.87
  pour Top (no thermals): 28.3,13.54 28.3,12.47 29.29,12.47 29.62,12.14 29.62,8.59 28.91,8.59 28.91,5.61 30.23,5.61 30.23,2.46 30.02,2.26 25.22,2.26 24.97,2.51 19.3,2.51 19.25,2.46 19.25,1.22 40.23,1.22 40.26,1.19 40.26,4.11 31.95,4.11 31.95,5.94 30.81,5.94 30.81,8.59 30.68,8.71 30.68,9.8 31.95,11.07 31.95,11.4 34.09,11.4 34.11,11.38 37.16,11.38 37.16,12.4 37.13,12.42 32,12.42 31.95,12.37 30.45,12.37 29.26,13.56 28.3,13.56 28.27,13.54
HEADER_RX
  Top 0.203: DEBUG.5 54.41,83.75 54.41,89.1 54.15,89.36 47.37,89.36 46.4,88.39 R35.2
HEADER_TX
  Top 0.203: DEBUG.7 54,81.62 54,88.57 53.62,88.95 51.33,88.95 50.55,88.17 R37.2
INT_ACCEL  (via drill 0.35)
  Top 0.203: U4.16 56.48,68.04 55.98,67.55 55.98,67.02 56.35,66.65 56.64,66.65 58.78,64.51 58.78,63.42 59.36,62.84 59.82,62.84 65.12,57.55 65.12,51.87 65.12,25.24 64.74,24.87 v63.45,24.87 | v62.25,12.08 61.86,12.47 61.86,12.55 61.6,12.81 U3.24
  Bottom 0.203: v62.25,12.08 62.25,12.59 62.17,12.67 62.17,13.12 61.62,13.66 61.62,15.24 63.91,17.52 63.91,20.25 63.66,20.5 63.66,21.31 63.91,21.56 63.91,21.95 63.91,22.45 63.91,23.66 63.59,23.97 63.59,24.73 v63.45,24.87
INT_GYRO  (via drill 0.35)
  Top 0.203: U4.12 59.53,64.49 59.13,64.09 59.13,63.57 59.5,63.2 59.97,63.2 65.47,57.7 65.47,25.09 64.61,24.23 v64.22,24.23 | U3.25 61.91,13.31 v63.23,11.99
  Bottom 0.203: v63.23,11.99 63.23,12.11 62.52,12.82 62.52,13.37 62.05,13.84 62.05,15.06 64.29,17.3 64.29,20.37 64.02,20.64 64.02,21.17 64.34,21.48 64.34,22.25 64.34,22.45 64.34,24.12 v64.22,24.23
L_EMITTER  (via drill 0.35)
  Top 0.254: U3.22 58.62,11.81 v55.12,15.32 | v56.24,29.64 v56.24,32.15 | v49.51,60.43 47.88,62.05 v46.58,62.05
  Top 0.508: R11.2 12.3,91.22 Q4.1 13.69,92.08 v13.69,92.2 | v16.69,92.2 18.64,90.25 v18.64,86.79
  Bottom 0.254: v55.12,15.32 55.12,15.64 57.17,17.69 57.17,28.71 v56.24,29.64 | v56.24,32.15 54.8,33.59 42.12,33.59 41.59,34.12 41.59,51.02 43.81,53.24 46.47,53.24 49.26,56.03 49.26,60.17 v49.51,60.43 | v46.58,62.05 45.5,62.05 20.23,87.33 19.18,87.33 v18.64,86.79
  Bottom 0.508: v13.69,92.2 v16.69,92.2
L_RECEIVER  (via drill 0.35)
  Top 0.254: v52.55,9.6 52.74,9.6 53.03,9.31 53.91,9.31 54.95,8.28 U3.8 | v30.1,95.15 30.1,93.95 R13.2
  Top 0.305: v8.43,67.33 11.07,67.33 v11.61,67.87
  Bottom 0.254: v52.55,9.6 52.55,10.77 44.17,19.15 36.41,19.15 34.98,17.73 18.91,17.73 14.03,22.6 14.03,66.43 12.57,67.89 11.63,67.89 v11.61,67.87 | v8.43,67.33 5.23,70.54 5.23,87.81 13.03,95.61 23.11,95.61 D4.E 24.8,95.15 v30.1,95.15
LED_B  (via drill 0.35)
  Top 0.203: U3.50 48.69,16.31 48.39,16.61 48.39,19.19 48.15,19.43 48.15,22.53 v47.97,22.72 | v42.01,27.94 v42.01,30.25 | v41.94,92.79 41.94,90.36 LED_B.A
  Bottom 0.203: v47.97,22.72 47.49,23.19 43.13,23.19 42.01,24.31 v42.01,27.94 | v42.01,30.25 42.01,30.69 41.46,31.24 41.46,33.67 40.83,34.3 40.83,50.8 43.65,53.62 46.31,53.62 48.88,56.19 48.88,73.58 47.63,74.83 47.63,76.59 48.19,77.15 48.19,87.84 43.25,92.79 v41.94,92.79
LED_G  (via drill 0.35)
  Top 0.203: U3.51 48.38,15.81 48.03,16.16 48.03,19.04 47.38,19.7 v47.38,22.02 | v41.1,27.94 v41.1,30.25 | v39.88,92.79 39.88,90.37 LED_G.A
  Bottom 0.203: v47.38,22.02 46.56,22.84 42.98,22.84 41.1,24.71 v41.1,27.94 | v39.88,92.79 41.04,92.79 41.67,92.15 43.38,92.15 47.78,87.75 47.78,77.25 47.27,76.74 47.27,74.68 48.44,73.51 48.44,56.26 46.16,53.98 43.47,53.98 40.47,50.98 40.47,34.16 41.1,33.52 v41.1,30.25
LED_R  (via drill 0.35)
  Top 0.203: U3.52 48.38,15.31 47.68,16.02 47.68,18.86 46.58,19.96 46.58,21.53 v46.51,21.61 | v40.19,27.94 v40.19,30.25 | v37.77,92.84 37.77,90.44 LED_R.A
  Bottom 0.203: v46.51,21.61 45.66,22.45 42.86,22.45 40.19,25.12 v40.19,27.94 | v37.77,92.84 38.93,92.84 39.97,91.8 43.18,91.8 47.33,87.65 47.33,77.29 46.92,76.88 46.92,74.53 48.09,73.36 48.09,56.41 46.01,54.34 43.32,54.34 40.12,51.13 40.12,34 40.75,33.37 40.75,30.8 v40.19,30.25
MISO  (via drill 0.35)
  Top 0.203: U4.15 57.03,66.88 v56.62,67.28 | v59.87,68.16 60.53,67.5 U4.10 60.53,66.57 59.99,66.03 59.99,65.98 59.99,65.89 59.99,64.57 61.19,63.37 61.19,63.03 66.19,58.03 66.19,24.81 62.9,21.51 59.97,21.51 57.95,19.49 U3.35
  Bottom 0.203: v56.62,67.28 58.99,67.28 v59.87,68.16
ML_IN1  (via drill 0.3)
  Top 0.254: U1.17 40.09,16.5 v39.8,16.79 | v46.2,12.94 48.04,12.94 48.17,12.81 U3.57
  Bottom 0.254: v39.8,16.79 40.82,15.77 45.77,15.77 46.35,15.19 46.35,13.1 v46.2,12.94
ML_IN2  (via drill 0.3)
  Top 0.254: U1.16 39.28,15.03 39.28,15.8 38.56,16.53 v38.56,17.45 | v47.22,13.57 47.45,13.35 48.21,13.35 48.25,13.31 U3.56
  Bottom 0.254: v38.56,17.45 38.59,17.42 44.75,17.42 46.97,15.21 46.97,13.83 v47.22,13.57
MOSI  (via drill 0.35)
  Top 0.203: U4.9 60.93,66.77 60.93,66.42 60.4,65.88 60.4,65.38 v60.84,64.93 | v59.77,63.83 59.84,63.83 65.83,57.84 65.83,24.95 62.75,21.87 59.82,21.87 57.45,19.49 U3.36
  Bottom 0.203: v60.84,64.93 59.77,63.86 v59.77,63.83
MOTOR_L_1
  Top 0.254: U1.11 U1.12
  Top 1.778: U1.12 35.91,21.96 34.46,23.4 26.28,23.4 24.74,24.94 24.74,28.6 25.91,29.77 MOTOR_RIGHT.2
MOTOR_L_2
  Top 0.406: U1.8 40.09,23.23 40.36,23.5 40.74,23.11 U1.7
  Top 1.27: 40.36,23.5 38.48,25.38
  Top 1.778: MOTOR_RIGHT.1 28.2,26.49 28.2,26.48 29.3,25.38 38.48,25.38
MOTOR_R_1  (via drill 1)
  Top 0.508: U1.2 U1.1
  Top 1.778: U1.1 44.65,24.29 v44.6,24.33
  Bottom 1.778: v44.6,24.33 44.6,28.57 45.8,29.77 MOTOR_LEFT.2
MOTOR_R_2
  Top 0.406: U1.6 41.4,22.7 42.05,23.35 | U1.5 42.05,23.35 | 42.05,23.35 42.06,23.37
  Top 1.016: 42.06,23.37 42.11,23.42
  Top 1.27: 42.11,23.42 42.11,25.81
  Top 1.778: 42.11,25.81 43.54,27.23 MOTOR_LEFT.1
MR_IN1
  Top 0.254: U1.21 42.7,13.95 44.83,11.81 U3.59
MR_IN2
  Top 0.254: U1.22 43.51,14.7 43.51,13.99 45.19,12.31 U3.58
N$1
  Top 0.813: R7.1 15.32,93 15.32,90.72 Q4.3
N$2
  Top 0.813: R7.2 12.96,94.17 13.76,94.97 20.88,94.97 L_EMITTER.-
N$3
  Top 0.203: LED_R.C 37.86,87.42 R14.2
N$4  (via drill 0.35)
  Top 0.813: Q1.3 13.34,83.44 v13.28,83.39 | v15.95,86.77 15.82,86.64 R6.1
  Bottom 0.813: v13.28,83.39 14.17,84.28 14.17,85.13 15.81,86.77 v15.95,86.77
N$5  (via drill 0.35)
  Top 0.813: v6.15,74.55 5.31,73.71 FL_EMITTER.- | v13.18,87.81 12.65,87.28 R6.2
  Bottom 0.813: v13.18,87.81 10.48,85.1 10.4,85.1 6.15,80.85 v6.15,74.55
N$6
  Top 0.203: LED_G.C 39.9,87.42 R4.2
N$7
  Top 1.016: Q5.3 72.92,84.4 71.07,86.25 R12.1
N$8
  Top 0.813: Q2.3 71.62,91.29 69.74,93.17 R9.1
N$9
  Top 0.203: LED_B.C 41.95,87.42 R5.2
N$10
  Top 0.508: RT.2 28.06,89.08 31.57,89.08 32.48,88.17 IC3.8
N$11
  Top 0.305: 28.27,87.13 RT.1
  Top 0.406: IC3.2 30.16,87.13 28.27,87.13
  Top 0.508: RT.1 C_VC.1 27.95,85.93 RB.2
N$12  (via drill 0.35)
  Top 1.016: v62.15,88.01 62.18,88.04 72.39,88.04 72.77,87.66 R12.2
  Bottom 1.016: R_EMITTER.- 59.13,88.01 v62.15,88.01
N$13  (via drill 0.35)
  Top 0.508: Q3.3 23.01,73.48 23.01,70.79 21.98,69.76 U$1.- 22.04,69.49 v22.99,69.49 | v20.17,65.33 21.25,64.25 U$4.-
  Bottom 0.508: v22.99,69.49 22.99,68.15 v20.17,65.33
N$14  (via drill 0.35)
  Top 1.016: v70.71,95.15 71.5,94.36 71.5,93.61 R9.2
  Bottom 1.016: v70.71,95.15 74.24,91.62 74.24,86.49 77.22,83.51 FR_EMITTER.-
N$15
  pour Top (no thermals): 28.55,8.03 28.55,6.25 24.69,6.25 23.88,5.44 22.83,5.44 22.83,10.13 22.78,10.19 24.1,10.19 25.5,8.79 26.95,8.79 26.95,8.03
N$16
  Top 0.254: R17.2 27.3,8.96 27.3,8.51 27.45,8.36 IC2.3
N$17
  Top 0.254: IC2.8 26.92,5.86 C14.2
N$18
  Top 0.305: IC2.2 28.56,9.31 IC2.1
  Top 0.508: IC2.1 29.06,11.03 C15.1
N$19
  Top 0.254: IC2.10 29.54,4.43 C18.1
N$20
  Top 0.152: R19.1 37.33,7.45
  Top 0.203: IC2.17 32.67,7.86 32.86,7.67 35.31,7.67 36.45,7.67 R19.1 | 37.33,7.45 R18.2
N$21
  Top 0.305: IC2.18 33.35,8.36 R20.1 33.14,8.8 C21.1
N$22
  Top 0.305: IC2.19 32.48,9.83 R21.1
N$23
  Top 0.305: R20.2 35.17,8.73 C23.1
N$24
  Top 0.254: C31.1 72.77,16.34 S1.1
N$25
  Top 0.254: S1.2 72.72,13.88 R_FBT.2 R_FBB.2
N$27  (via drill 0.3)
  Top 0.254: S1.3 v71.74,13.04 v71.73,13.03 | v69.34,11.61 69.34,10.82 R23.1
  Bottom 0.254: v71.73,13.03 70.31,11.61 v69.34,11.61
N$31
  Top 0.254: R25.2 5V_PWR.C
N$32  (via drill 0.35)
  Top 0.305: v14.81,82.35 14.35,82.35 13.69,81.69 12.98,81.69 R33.2
  Bottom 0.305: BOOT.4 19.32,83.57 16.03,83.57 v14.81,82.35
N$33  (via drill 0.35)
  Top 0.305: U$10.2 7.16,14.5 v7.16,13.16 | v18.52,15.29 20.46,17.23 R26.2
  Bottom 0.305: v7.16,13.16 8,13.99 17.22,13.99 v18.52,15.29
N$34
  Top 0.305: BOOT.3 19.41,79.91 18.34,78.84 15.47,78.84 R34.1
N$35
  Top 0.305: BTN_SEL.1 BTN_SEL.2 63.25,68.2 63.25,73.44 61.23,75.46 58.85,75.46 58.29,74.91 55.07,74.91 54.2,74.04 54.2,72.11 55.57,70.74 55.57,61.19 R29.2 56.68,60.08 R30.1
N$36
  Top 0.254: C45.1 62.67,16.31 U3.31
N$37
  Top 0.254: C46.1 51.95,20.45 U3.47
N$38  (via drill 0.35)
  Top 0.305: SW.1 15.37,12.06 v16.41,13.11 | v24.51,15.6 22.87,17.24 R28.2
  Top 1.778: SW.1 SW.2_COM 9.32,14.88 U$10.3
  Bottom 0.305: v16.41,13.11 17.36,13.11 18.63,14.37 23.29,14.37 v24.51,15.6
PWM_L  (via drill 0.3, 0.35)
  Top 0.254: U1.15 38.8,15.71 36.98,17.53 v36.98,17.75 | v42.39,9.96 42.55,10.11 43.63,10.11 44.33,10.81 U3.61
  Bottom 0.254: v36.98,17.75 36.98,11.73 39.06,9.65 42.09,9.65 v42.39,9.96
PWM_R  (via drill 0.3)
  Top 0.254: U1.23 44.16,14.7 44.16,13.99 44.53,13.61 v45.57,13.61 | U3.62 45.82,10.31 v45.64,10.13
  Bottom 0.254: v45.57,13.61 45.57,10.21 v45.64,10.13
R_EMITTER  (via drill 0.35)
  Top 0.203: U3.27 59.22,14.31 58.62,14.91 58.62,15.23 v58.09,15.76 | v58.27,27.43 58.5,27.66 58.5,28.21 60.14,29.85 v60.14,30.49
  Top 0.254: v53.47,68.68 53.87,69.09 v53.87,71.09 | v67.82,81.61 68.71,82.5 R15.2 69.62,83.15 Q5.1
  Bottom 0.203: v58.09,15.76 59.02,15.76 60.96,17.7 60.96,18.35 | 60.91,18.4 60.91,19.55 61.98,20.62 61.98,23.37 59.21,26.14 59.21,26.49 v58.27,27.43 | v60.14,30.49 61.71,32.05 62.38,32.05 64.54,34.22
  Bottom 0.254: v53.47,68.68 53.47,67.78 60.71,60.53 60.71,56.76 64.54,52.93 64.54,34.22 | v53.87,71.09 58.67,75.89 65.05,75.89 67.82,78.66 v67.82,81.61
  Bottom 0.305: 60.96,18.35 60.91,18.4
R_RECEIVER  (via drill 0.35)
  Top 0.254: U3.11 56.45,8.61 56.92,9.07 56.92,9.98 v56.95,10.01
  Top 0.305: R2.2 52.62,96.47 D6.E
  Bottom 0.203: 65.38,16.94 65.89,17.45 65.89,59.01 64.93,59.96 64.93,65.04 65.38,65.49 | 72.77,85.88
  Bottom 0.254: 65.38,65.49 68.21,68.32 71.78,68.32 73.99,70.54 73.99,84.66 72.77,85.88 | v56.95,10.01 62.3,10.01 64.59,12.3 64.59,13.82 64.6,13.82 65.38,14.6 65.38,16.94
  Bottom 0.305: D6.E 67.05,96.47 72.77,90.75 72.77,85.88
RESET  (via drill 0.35)
  Top 0.203: U3.7 54.45,8.24 54.03,8.65 v53.54,8.65 | C36.1 11.83,71.64 BTN_RST.3 11.96,71.77 v11.96,73.36 11.86,73.46 BTN_RST.4
  Bottom 0.203: v53.54,8.65 46.27,8.65 43.99,10.93 43.99,11.03 43.62,11.4 42.94,11.4 41.58,10.03 39.27,10.03 37.59,11.72 37.59,18.01 37.23,18.36 36.73,18.36 35.31,16.94 18.57,16.94 13.24,22.27 13.24,65.82 12.74,66.32 12.21,66.32 10.16,68.37 10.16,71.55 v11.96,73.36
RX
  Top 0.203: R35.1 R32.1 48.47,84.43 50.7,82.19 50.7,57.89 44.4,51.59 42.05,51.59 41.41,50.95 41.41,34.05 42.13,33.33 53.16,33.33 53.95,32.54 U3.43
SCK  (via drill 0.35)
  Top 0.203: U4.8 62.26,67.23 62.26,63.48 67.26,58.47 67.26,45.64 67.26,23.52 v64.65,20.9 | v63.16,13.08 62.88,13.36 62.52,13.36 61.86,14.01 61.86,15.05 61.6,15.31 U3.29
  Bottom 0.203: v63.16,13.08 63.55,13.47 63.55,16.06 64.65,17.16 v64.65,20.9
SCL  (via drill 0.35)
  Top 0.203: v51.62,28.14 52.18,28.7 51.52,29.35 51.52,30.19 52.44,31.11 v52.44,32.34 | U3.41 54.95,22.09 v55.08,22.23 | v42.5,31.62 39.62,31.62 v39.39,31.85
  Bottom 0.203: OLED.3 44.34,76.63 45.37,76.63 46.2,75.8 46.2,74.24 47.38,73.07 47.38,56.7 45.72,55.05 43.03,55.05 39.39,51.41 v39.39,31.85 | v55.08,22.23 53.59,23.71 53.59,27.89 53.24,28.25 52.12,28.25 52.01,28.14 v51.62,28.14 | v52.44,32.34 51.86,32.92 43.51,32.92 42.5,31.9 v42.5,31.62
SDA  (via drill 0.35)
  Top 0.203: v55.99,23.13 55.99,20.68 55.45,20.14 U3.40 | v51.51,32.15 51.51,30.68 51.17,30.34 51.17,29.11 v50.91,28.85 | v43.56,31.85 43.16,31.85 42.76,32.26 40.27,32.26 v40.12,32.41
  Bottom 0.203: OLED.4 43.81,78.69 46.56,75.94 46.56,74.38 47.73,73.21 47.73,56.56 45.87,54.69 43.17,54.69 39.76,51.27 39.76,33.83 40.12,33.48 v40.12,32.41 | v55.99,23.13 53.95,25.18 53.95,28.19 53.38,28.75 52.12,28.75 52.02,28.85 v50.91,28.85 | v51.51,32.15 51.1,32.56 44.27,32.56 v43.56,31.85
SWCLK  (via drill 0.35)
  Top 0.203: v52.58,76.33 58.52,76.33 58.52,76.91 58.92,77.3 58.92,78.74 DEBUG.6 | v48.26,76.33 44.6,72.67 44.6,52.8 44.11,52.3 41.75,52.3 40.7,51.25 40.7,33.75 41.84,32.61 48.03,32.61 48.98,31.66 48.98,26.81 49.49,26.3 49.49,24 48.72,23.23 48.72,19.51 48.69,19.48 49.53,18.64 U3.49
  Bottom 0.203: v52.58,76.33 v48.26,76.33
SWDIO  (via drill 0.35)
  Top 0.203: v52.58,75.42 58.12,75.42 58.88,76.18 58.88,76.76 59.27,77.15 59.27,78.44 59.72,78.44 DEBUG.8 | v48.26,75.42 44.96,72.12 44.96,52.65 44.26,51.95 41.9,51.95 41.05,51.1 41.05,33.9 41.98,32.97 52.7,32.97 53.59,32.08 53.59,21.41 53.29,21.11 52.96,21.11 52.45,20.6 U3.46
  Bottom 0.203: v52.58,75.42 v48.26,75.42
TX
  Top 0.203: R36.1 R37.1 51.21,84.58 51.21,57.9 44.55,51.24 42.2,51.24 41.76,50.8 41.76,34.2 42.2,33.76 53.23,33.76 54.45,32.54 U3.42
V_BAT  (via drill 0.35, 0.65)
  Top 0.152: S1.7 76.15,14.28 77.6,14.28 C32.1
  Top 1.27: 16.51,7.82 16.51,9.98 v16.71,10.19 | 76.43,16.33 77.11,15.65
  Top 1.778: SW.3 4.65,12.06 8.88,7.82 16.51,7.82 L1.1
  Bottom 1.27: v16.71,10.19 16.71,8.43 21.49,3.66 72.72,3.66 76.56,7.49 76.56,11.63 78.05,13.13 78.05,15.75 v77.65,16.15
  pour Top (no thermals): 19.33,10.24 20.78,10.24 20.78,4.37 20.8,4.34 27.3,4.34 27.3,5.38 28.52,5.38 28.52,3.23 19.33,3.23
  pour Top (no thermals): 75.92,13.67 75.51,13.67 75.51,16.99 78.79,16.99 78.79,14.1 78.51,13.82 77.06,13.82 77.06,14.17 77.06,14.27 76.15,14.27 75.92,14.05
VOLTM_BATT  (via drill 0.35, 0.65)
  Top 0.305: R28.1 R31.2 23.66,13.55 v24.69,12.52 | U3.17 60.22,8.66 v60.22,8.56
  Bottom 0.305: v24.69,12.52 24.69,12 31.33,5.36 42.22,5.36 43.23,6.38 45.03,6.38 46.28,5.13 60.35,5.13 61.19,5.97 61.19,7.59 v60.22,8.56
VOLTM_BOOST  (via drill 0.3)
  Top 0.305: R24.2 49.49,2.18 R22.1 44.67,5.59 v44.12,5.59 | v61.34,8.66 60.07,7.39 U3.16
  Bottom 0.305: v44.12,5.59 45.09,4.62 60.91,4.62 61.7,5.41 61.7,8.53 61.57,8.66 v61.34,8.66
VOLTM_CELL1  (via drill 0.35, 0.65)
  Top 0.254: U3.20 59.91,10.81 59.74,10.64 59.74,9.12 v59.31,8.69
  Top 0.305: R26.1 R27.2 v18.98,13.54 v18.97,13.54
  Bottom 0.305: v18.97,13.54 25.2,13.54 31.9,6.83 45.22,6.83 46.47,5.59 59.31,5.59 v59.31,8.69

## Text on the board
tPlace: R | G | B | BOOT1 | 3.3V | 0 | 1 | GND | SB01 | SB02 | SB03 | SB04 | 1 | 0 | RX | SWCLK | BOOT0 | RESET | TX | SWDIO | SELECT | TB6612FNG | STM32F405RG
bPlace: Jerry V1.0 / Designed by Isak Åslund / Sweden | Fall 2019 / github.com/elixir7/micromouse